# EAGLE design sd-logger (EAGLE 9.6.2)
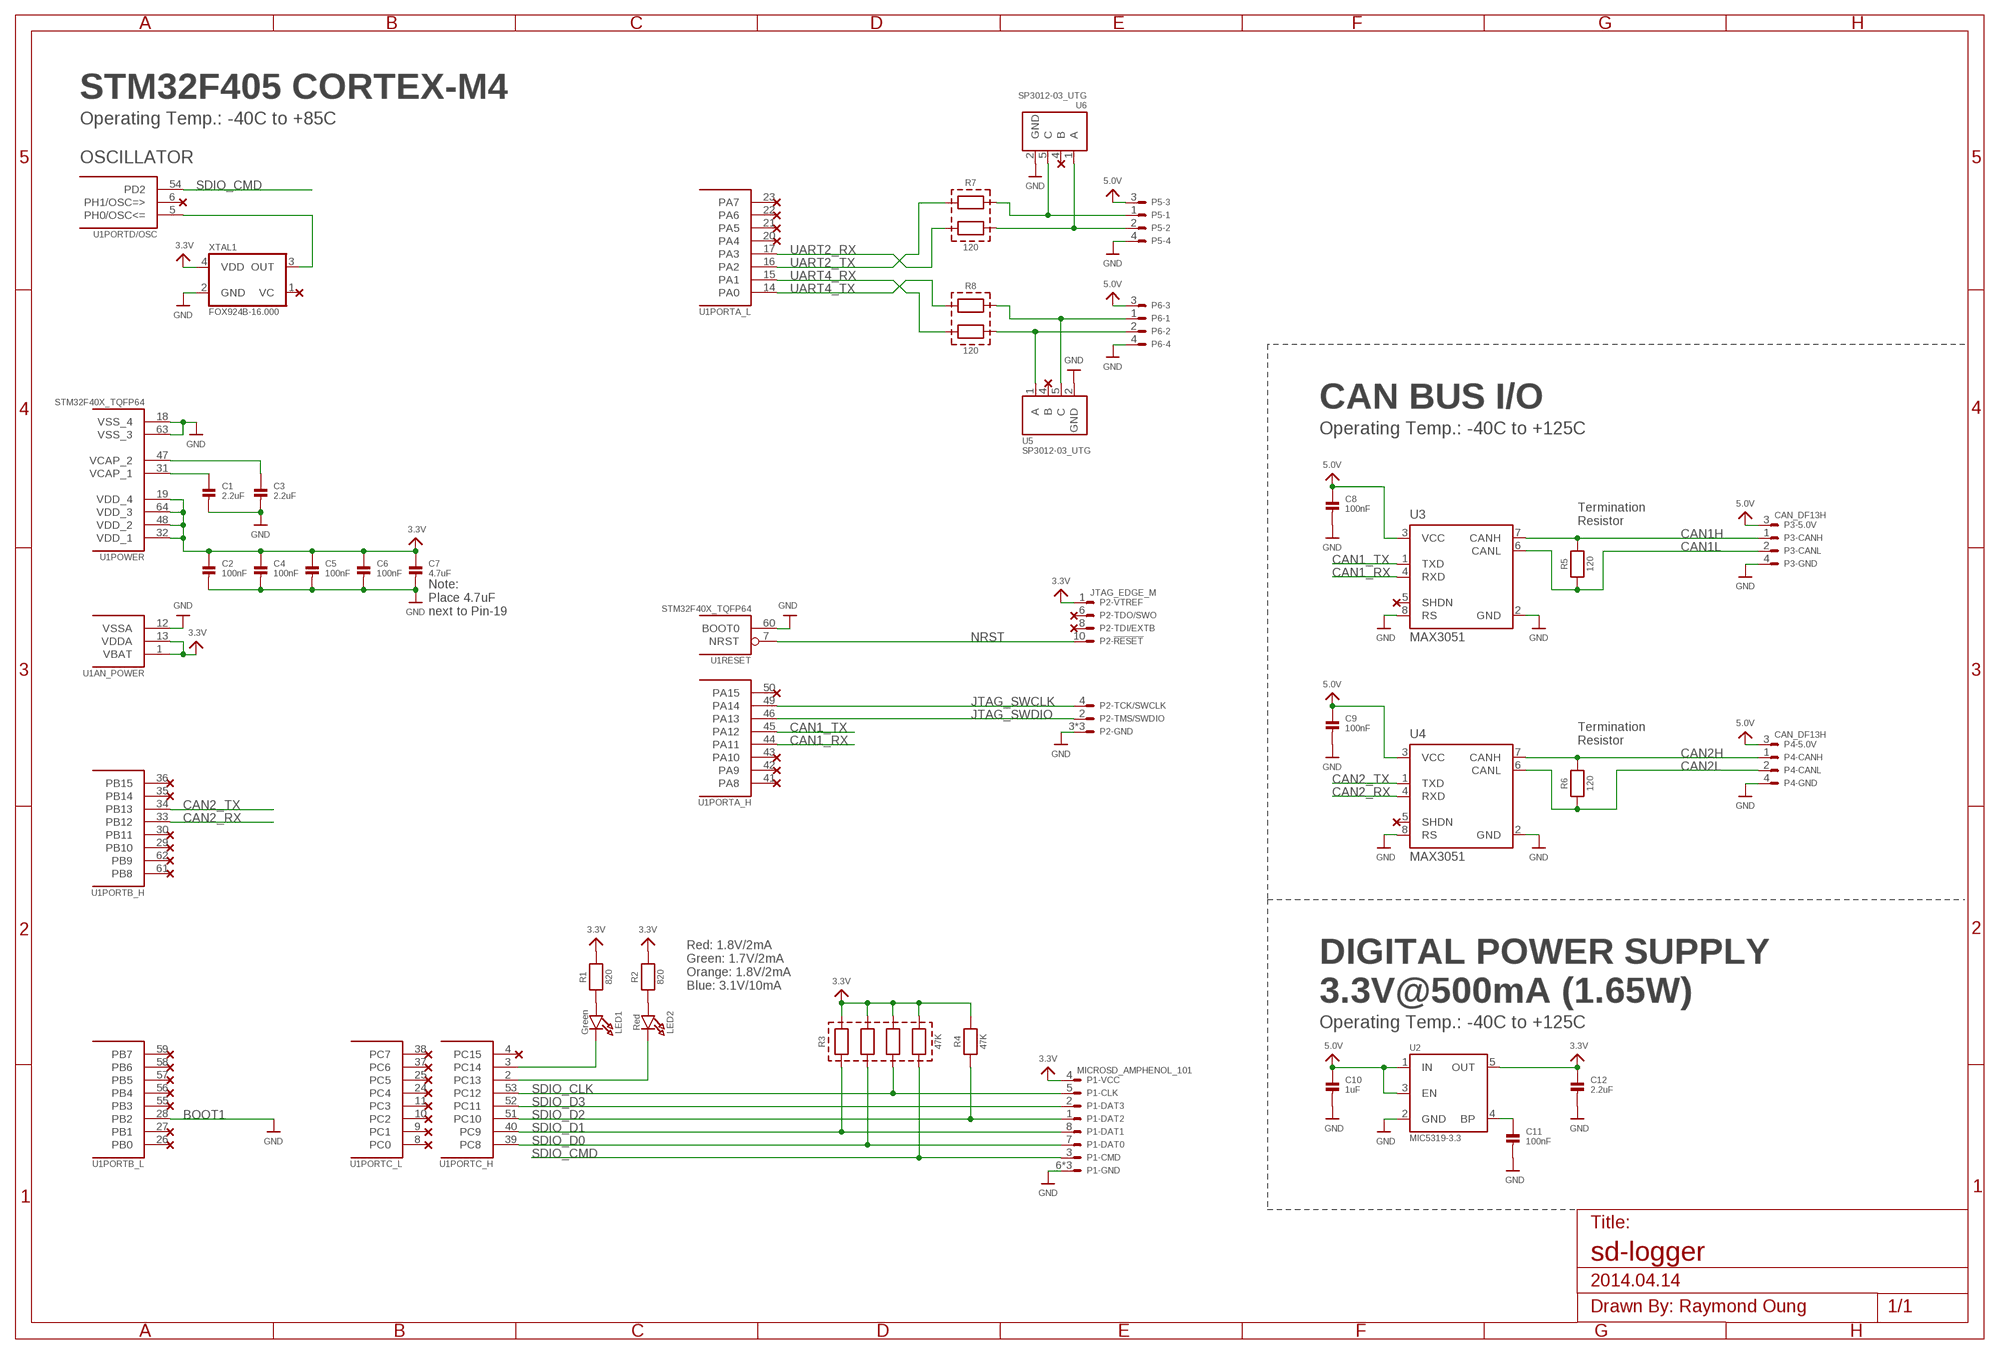
[diagram p0: schematic, sheet 1]

## Parts
C1  2.2uF  CAP_CERAMIC0402  [0402]
C2  100nF  CAP_CERAMIC0402  [0402]
C3  2.2uF  CAP_CERAMIC0402  [0402]
C4  100nF  CAP_CERAMIC0402  [0402]
C5  100nF  CAP_CERAMIC0402  [0402]
C6  100nF  CAP_CERAMIC0402  [0402]
C7  4.7uF  CAP_CERAMIC0402  [0402]
C8  100nF  CAP_CERAMIC0402  [0402]
C9  100nF  CAP_CERAMIC0402  [0402]
C10  1uF  CAP_CERAMIC0402  [0402]
C11  100nF  CAP_CERAMIC0402  [0402]
C12  2.2uF  CAP_CERAMIC0402  [0402]
LED1  Green  LED_0603  [CHIPLED_0603]
LED2  Red  LED_0603  [CHIPLED_0603]
P1  MICROSD_AMPHENOL_101  [AMPHENOL_101-00660-68]
P2  JTAG_EDGE_M  [FTSH-105-01-XXX-DV-EDGE]
P3  CAN_DF13H  [DF13A-4P-1.25H]
P4  CAN_DF13H  [DF13A-4P-1.25H]
P5  M04_DF13H  [DF13A-4P-1.25H]
P6  M04_DF13H  [DF13A-4P-1.25H]
R1  820  RESISTOR0402  [0402]
R2  820  RESISTOR0402  [0402]
R3  47K  RESISTOR4_0603X4  [EXBV8V]
R4  47K  RESISTOR0402  [0402]
R5  120  RESISTOR0603  [0603]
R6  120  RESISTOR0603  [0603]
R7  120  RESISTOR2_0603X2  [EXBV4V]
R8  120  RESISTOR2_0603X2  [EXBV4V]
U1  STM32F40X_TQFP64  [TQFP64]
U2  MIC5319-3.3  [SOT23-5]
U3  MAX3051  [SOT23-8]
U4  MAX3051  [SOT23-8]
U5  SP3012-03_UTG  [UDFN06]
U6  SP3012-03_UTG  [UDFN06]
XTAL1  FOX924B-16.000  TCXO_5.0X3.2  [OSCILLATOR-5.0X3.2]

## Nets
3.3V: C2.1 C4.1 C5.1 C6.1 C7.1 C12.1 P1.4 P2.1 R1.2 R2.2 R3.5 R3.6 R3.7 R3.8 R4.2 U1.1(AN_POWER:VBAT) U1.13(AN_POWER:VDDA) U1.19(POWER:VDD_4) U1.32(POWER:VDD_1) U1.48(POWER:VDD_2) U1.64(POWER:VDD_3) U2.5(OUT) XTAL1.4(VDD)
5.0V [PWR]: C8.1 C9.1 C10.1 P3.3 P4.3 P5.3 P6.3 U2.1(IN) U2.3(EN) U3.3(VCC) U4.3(VCC)
CAN1_RX: U1.44(PORTA_H:PA11) U3.4(RXD)
CAN1_TX: U1.45(PORTA_H:PA12) U3.1(TXD)
CAN1H: P3.1 R5.2 U3.7(CANH)
CAN1L: P3.2 R5.1 U3.6(CANL)
CAN2_RX: U1.33(PORTB_H:PB12) U4.4(RXD)
CAN2_TX: U1.34(PORTB_H:PB13) U4.1(TXD)
CAN2H: P4.1 R6.2 U4.7(CANH)
CAN2L: P4.2 R6.1 U4.6(CANL)
GND: C1.2 C2.2 C3.2 C4.2 C5.2 C6.2 C7.2 C8.2 C9.2 C10.2 C11.2 C12.2 P1.6 P1.GND1 P1.GND3 P2.3 P2.5 P2.9 P3.4 P4.4 P5.4 P6.4 U1.12(AN_POWER:VSSA) U1.18(POWER:VSS_4) U1.28(PORTB_L:PB2) U1.60(RESET:BOOT0) U1.63(POWER:VSS_3) U2.2(GND) U3.2(GND) U3.8(RS) U4.2(GND) U4.8(RS) U5.2(GND) U6.2(GND) XTAL1.2(GND)
JTAG_SWCLK: P2.4 U1.49(PORTA_H:PA14)
JTAG_SWDIO: P2.2 U1.46(PORTA_H:PA13)
N$1: P5.2 R7.3 U6.1(A)
N$2: LED1.C U1.3(PORTC_H:PC14)
N$3: U1.5(PORTD/OSC:PH0/OSC<=) XTAL1.3(OUT)
N$4: C11.1 U2.4(BP)
N$5: P5.1 R7.4 U6.5(C)
N$6: P6.2 R8.3 U5.1(A)
N$7: P6.1 R8.4 U5.5(C)
N$16: LED2.C U1.2(PORTC_H:PC13)
N$18: LED2.A R2.1
N$20: LED1.A R1.1
NRST: P2.10 U1.7(RESET:NRST)
SDIO_CLK: P1.5 R3.3 U1.53(PORTC_H:PC12)
SDIO_CMD: P1.3 R3.4 U1.54(PORTD/OSC:PD2)
SDIO_D0: P1.7 R3.2 U1.39(PORTC_H:PC8)
SDIO_D1: P1.8 R3.1 U1.40(PORTC_H:PC9)
SDIO_D2: P1.1 R4.1 U1.51(PORTC_H:PC10)
SDIO_D3: P1.2 U1.52(PORTC_H:PC11)
UART2_RX: R7.2 U1.17(PORTA_L:PA3)
UART2_TX: R7.1 U1.16(PORTA_L:PA2)
UART4_RX: R8.2 U1.15(PORTA_L:PA1)
UART4_TX: R8.1 U1.14(PORTA_L:PA0)
VCAP_3 [PWR]: C3.1 U1.47(POWER:VCAP_2)
VCAP_4 [PWR]: C1.1 U1.31(POWER:VCAP_1)
Unconnected: P2.6 P2.8 U1.4(PORTC_H:PC15) U1.6(PORTD/OSC:PH1/OSC=>) U1.8(PORTC_L:PC0) U1.9(PORTC_L:PC1) U1.10(PORTC_L:PC2) U1.11(PORTC_L:PC3) U1.20(PORTA_L:PA4) U1.21(PORTA_L:PA5) U1.22(PORTA_L:PA6) U1.23(PORTA_L:PA7) U1.24(PORTC_L:PC4) U1.25(PORTC_L:PC5) U1.26(PORTB_L:PB0) U1.27(PORTB_L:PB1) U1.29(PORTB_H:PB10) U1.30(PORTB_H:PB11) U1.35(PORTB_H:PB14) U1.36(PORTB_H:PB15) U1.37(PORTC_L:PC6) U1.38(PORTC_L:PC7) U1.41(PORTA_H:PA8) U1.42(PORTA_H:PA9) U1.43(PORTA_H:PA10) U1.50(PORTA_H:PA15) U1.55(PORTB_L:PB3) U1.56(PORTB_L:PB4) U1.57(PORTB_L:PB5) U1.58(PORTB_L:PB6) U1.59(PORTB_L:PB7) U1.61(PORTB_H:PB8) U1.62(PORTB_H:PB9) U3.5(SHDN) U4.5(SHDN) U5.4(B) U6.4(B) XTAL1.1(VC)

## Notes on the sheet
- STM32F405 CORTEX-M4
- Operating Temp.: -40C to +85C
- OSCILLATOR
- CAN BUS I/O
- Operating Temp.: -40C to +125C
- Termination
  Resistor
- Note: 
  Place 4.7uF 
  next to Pin-19
- Termination
  Resistor
- Red: 1.8V/2mA
  Green: 1.7V/2mA
  Orange: 1.8V/2mA
  Blue: 3.1V/10mA
- DIGITAL POWER SUPPLY
  3.3V@500mA (1.65W)
- Operating Temp.: -40C to +125C
- BOOT1
- 2014.04.14

## Library data of the parts
C1-C12 = custom-generic:CAP_CERAMIC: Ceramic Capacitor 0402 - 0402 Surface Mount Capacitors 16pF 50V 5% [Digikey: 445-4899-2-ND] 18pF 50V 5% [Digikey: 490-1281-2-ND] 22pF 50V 5% [Digikey: 490-1283-2-ND] 68pF 50V 5% [Digikey: 490-1289-2-ND] 0.1uF 10V 10% [Digikey: 490-1318-2-ND] 1.0uF 6.3V 10% [Digikey: 490-1320-2-ND] 0603 - 0603 Surface Mount Capacitors 16 pF 50V 5% [Digikey: 445-5051-2-ND] 22 pF 50V [Digikey: PCC220ACVTR-ND] 33 pF 50V 5% [Digikey: 490-1415-1-ND] 56pF 50V 5% [Digikey: 490-1421-1-ND] 220pF 50V 5% [Digikey: 445-1285-1-ND] 680 pF 50V 2200 pF 50V 5% C0G [Digikey: 445-1297-1-ND] 5600 pF 100V 5% X7R [Digikey: 478-3711-1-ND] 0.1 µF 25V 10% [Digikey: PCC2277TR-ND] 0.22 µF 16V 10% X7R [Digikey: 445-1318-1-ND] 1.0 µF 25V 10% [Digikey: 445-5146-2-ND] 0603 - RF Specific 3pF 250V +/-0.1pF RF [Digikey: 712-1347-1-ND] 18 pF 250V 5% [Digikey: 478-3505-1-ND or 712-1322-1-ND] 56 pF 250V 5% C0G RF [Digikey: 490-4867-1-ND] 68 pF 250V RF [Digikey: 490-4868-1-ND] 0805 - 0805 Surface Mount Capacitors 220 pF 250V 2% RF Ceramic Capacitor [Digikey: 712-1398-1-ND] 1000 pF 50V 2% NP0 Ceramic Capacitor [Digikey: 478-3760-1-ND] 0.1 µF 25V 10% Ceramic Capacitor [Digikey: PCC1828TR-ND] 1.0 µF 16V 10% Ceramic Capacitor[Digikey: 490-1691-2-ND] 10.0 µF 10V 10% Ceramic Capacitor[Digikey: 709-1228-1-ND] 10.0 uF 16V 10% Ceramic Capacitor [Digikey: 478-5165-2-ND] 47 uF 6.3V 20% Ceramic Capacitor [Digikey: 587-1779-1-ND or 399-5506-1-ND] 1206 - 1206 Surface Mount Capacitors 47uF 10V 20% Ceramic Capacitor [Digikey: 490-5528-1-ND or 399-5508-1-ND or 445-6010-1-ND]
LED1 LED2 = custom-generic:LED: LED 0603 - 0603 Surface Mount Package 2mA: Blue LED - Low Power (39.2mcd, 10 mA, 3.1Vf) - DigiKey: 475-1383-1-ND Green LED - Low Power (3.9mcd, 2mA, 1.7Vf) - Digikey: 475-2709-1-ND Orange LED - Low Power (9.8mcd, 2mA, 1.8Vf) - Digikey: 475-1194-2-ND Red LED - Low Power (5mcd, 2mA, 1.8Vf) - Digikey: 475-2506-1-ND Yellow LED - Low Power (7mcd, 2mA, 1.8Vf) - Digikey: 475-1196-1-ND 5mA: Blue LED - Low Power (17mcd, 5ma, 2.9Vf) - Digikey: LNJ937W8CRACT-ND 0805 - 0805 Surface Mount Package 2mA: Red LED (8.8mcd, 2mA, 1.8Vf, Clear) - Low Power [Digikey: 475-2510-1-ND] Green LED (5mcd, 2mA, 1.8Vf, Clear) - Low Power [Digikey: 475-2730-1-ND] Yellow LED (11.3mcd, 2mA, 1.8Vf, Clear) - Low Power [Digikey: 475-2555-1-ND] 20mA: Red LED (104mcd, 20mA, Diffused) - LS R976 [Digikey: 475-1278-6-ND] Red LED (12mcd, 20mA, 2.0Vf, Clear) - APT2012EC [Digikey: 754-1128-1-ND] Green LED (15mcd, 20mA, 2.2Vf, Clear) - APT2012GC [Digikey: 754-1131-1-ND] Orange LED (160mcd, 20mA, 2.1Vf, Clear) - APT2012SECK [Digikey: 754-1130-1-ND] 1206 - 1206 Surface Mount Package Green LED (26mcd, 20mA, Diffused) - LG N971 [Digikey: 475-1407-6-ND] Red LED (15mcd, 20mA, Diffused) - LH N974 [Digikey: 475-1416-6-ND]
P1 = custom-connectors:MICROSD: SD Card; DIGI-KEY: 101-00660-68-6-1-ND; MOUSER: 523-101-00660-68-6
P2 = custom-connectors:JTAG: JTAG Connector; DIGI-KEY: 952-1383-ND; MOUSER: 855-M50-3500542; TEMPERATURE: -40°C to 105°C
P3 P4 = custom-connectors:CAN: CAN Bus Connector; DIGI-KEY: H3369-ND; MOUSER: 798-DF13A4P125H20
P5 P6 = custom-connectors:M04: 4-Way Connector; DIGI-KEY: H3369-ND; MOUSER: 798-DF13A4P125H20; TEMPERATURE: -35°C to +85°C
R1 R2 R4-R6 = custom-generic:RESISTOR: Resistors 0402 - 0402 Surface Mount Package 22 Ohm 1% 1/16W [Digikey: 311-22.0LRTR-ND] 33 Ohm 5% 1/16W 1.0K 5% 1/16W 1.5K 5% 1/16W 2.0K 1% 1/16W 10.0K 1% 1/16W [Digikey: 311-10.0KLRTR-ND] 10.0K 5% 1/16W [Digikey: RMCF0402JT10K0TR-ND] 12.1K 1% 1/16W [Digikey: 311-22.0LRTR-ND] 100.0K 5% 1/16W 0603 - 0603 Surface Mount Package 0 Ohm 1/10 Watt 1% Resistor 15 Ohm 1/10 Watt 1% Resistor 33 Ohm 1/10 Watt 1% Resistor 49.9 Ohm 1/10 Watt 1% Resistor 100 Ohm 1/10 Watt 1% Resistor 150 Ohm 1/10 Watt 1% Resistor 240 Ohm 1/10 Watt 1% Resistor 390 Ohm 1/10 Watt 1% Resistor 560 Ohm 1/10 Watt 1% Resistor 680 Ohm 1/10 Watt 1% Resistor 750 Ohm 1/10 Watt 1% Resistor 1.0K Ohm 1/10 Watt 1% Resistor 1.5K Ohm 1/10 Watt 1% Resistor 2.0K Ohm 1/10 Watt 1% Resistor 2.2K Ohm 1/10 Watt 1% Resistor 3.3K Ohm 1/10 Watt 1% Resistor 4.7K Ohm 1/10 Watt 1% Resistor 10.0K Ohm 1/10 Watt 1% Resistor 12.0K Ohm 1/10 Watt 1% Resistor 12.1K Ohm 1/10 Watt 1% Resistor 20.0K Ohm 1/10 Watt 1% Resistor 33.0K Ohm 1/10 Watt 1% Resistor 100.0K Ohm 1/10 Watt 1% Resistor 0805 - 0805 Surface Mount Package 0 Ohm 1/8 Watt 1% Resistor 33 Ohm 1/8 Watt 1% Resistor 100 Ohm 1/8 Watt 1% Resistor 150 Ohm 1/8 Watt 1% Resistor 200 Ohm 1/8 Watt 1% Resistor 240 Ohm 1/8 Watt 1% Resistor 330 Ohm 1/8 Watt 1% Resistor 390 Ohm 1/8 Watt 1% Resistor 470 Ohm 1/8 Watt 1% Resistor 1.0K Ohm 1/8 Watt 1% Resistor 1.5K Ohm 1/8 Watt 1% Resistor 2.0K Ohm 1/8 Watt 1% Resistor 4.7K Ohm 1/8 Watt 1% Resistor 5.1K Ohm 1/8 Watt 1% Resistor 5.6K Ohm 1/8 Watt 1% Resistor 10.0K Ohm 1/8 Watt 1% Resistor 22.0K Ohm 1/8 Watt 1% Resistor 33.0K Ohm 1/8 Watt 1% Resistor 100K Ohm 1/8 Watt 1% Resistor 1206 - 1206 Surface Mount Package 2012 - 2010 Surface Mount Package 0.11 Ohm 1/2 Watt 1% Resistor - Digikey: RHM.11UCT-ND
R3 = custom-generic:RESISTOR4: 4x Isolated Resistor Network
R7 R8 = custom-generic:RESISTOR2: 2x Isolated Resistor Network
U1 = custom-devices:STM32F40X_TQFP64: STM32F40x 64-pin LQFP; DIGI-KEY: 497-11767-ND; MOUSER: 511-STM32F405RGT6
U2 = custom-devices:MIC5319-3.3: 3.3V Linear Voltage Regulator; DIGI-KEY: 576-1910-1-ND; MOUSER: 998-MIC5319-3.3YD5TR
U3 U4 = custom-devices:MAX3051: CAN Transceiver; DIGI-KEY: MAX3051EKA+TCT-ND; MOUSER: 700-MAX3051EKAT
U5 U6 = custom-devices:SP3012-03: TVS Diode Arrays 3-Ch 12KV 0.5pF; DIGI-KEY: F6292CT-ND; MOUSER: 576-SP3012-03UTG; TEMPERATURE: -40°C to +125°C
XTAL1 = custom-generic:TCXO: Temperature Compensated Crystal Oscillator

## Net classes
0 default: width 0.203 mm, drill 0.305 mm, clearance 0.203 mm
1 PWR: width 0.203 mm, drill 0.305 mm, clearance 0.203 mm

## Board
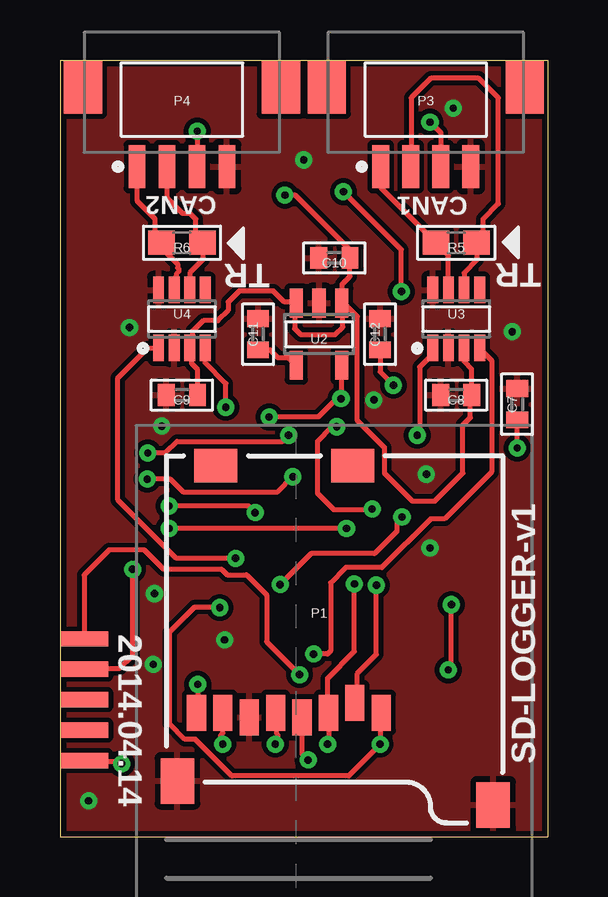
[diagram p1: board, top side]
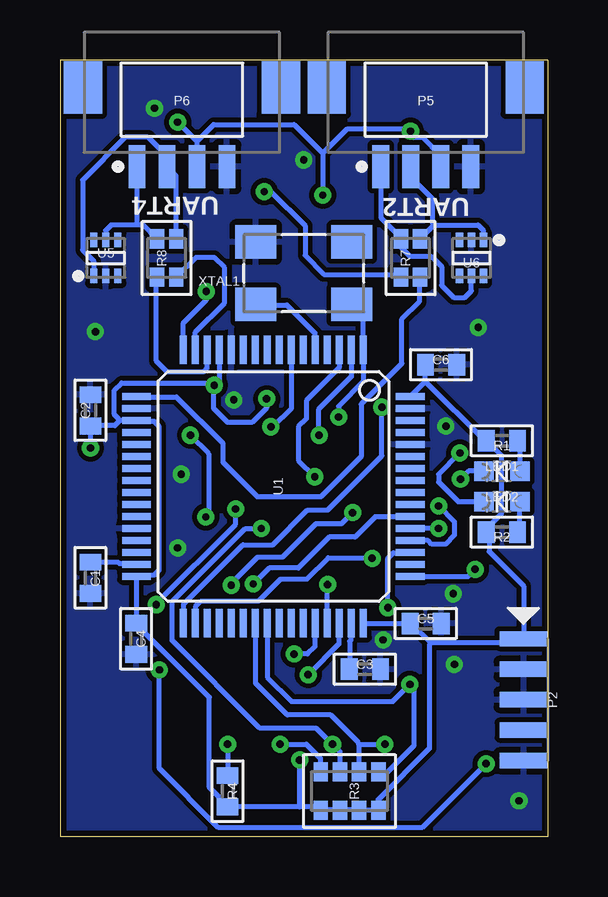
[diagram p2: board, bottom side, seen from below]

Size 20.32 x 32.38 mm. Coordinates in mm from the lower left corner, seen from the top.
Outline: 0,0 20.32,0 20.32,32.38 0,32.38 0,0
Copper layers (1*16): Top 0.035mm / dielectric 1.5mm / Bottom 0.035mm
Design rules "BetaLayout-2layer": minimum track width 6mil, minimum drill 8mil, track to track 6mil, track to pad 6mil, pad to pad 6mil, via to via 6mil, smd to smd 0mil, copper to edge 10mil, drill to drill 10mil, minimum pad ring 10mil, minimum via ring 8mil, stop-mask expansion 2mil, vias tented up to drill 100mil, thermal gap 10mil

### Footprints (pad centres in the part's own frame; a part is rotated, then mirrored left to right if it is on the bottom)
0402 = smd 0.7 x 0.9: 1 -0.65,0; 2 0.65,0
CHIPLED_0603 = smd 0.8 x 0.8: A 0,-0.75; C 0,0.75
AMPHENOL_101-00660-68 = smd 0.8 x 1.5: 1 -8.94,10.7; 2 -7.84,10.3; 3 -6.74,10.7; 4 -5.64,10.9; 5 -4.54,10.7; 6 -3.44,10.9; 7 -2.34,10.7; 8 -1.24,10.7 | smd 1.8 x 1.4: CD1 -2.05,0.4; CD2 -7.75,0.4 | smd 1.4 x 1.9: GND1 -13.6,14.55; GND3 -0.45,13.55
FTSH-105-01-XXX-DV-EDGE = smd 0.635 x 2: 1 -2.54,-1; 3 -1.27,-1; 5 0,-1; 7 1.27,-1; 9 2.54,-1 | smd 0.635 x 2 bottom: 2 -2.54,-1; 4 -1.27,-1; 6 0,-1; 8 1.27,-1; 10 2.54,-1
DF13A-4P-1.25H = smd 0.7 x 1.8: 1 -1.875,0; 2 -0.625,0; 3 0.625,0; 4 1.875,0 | smd 1.6 x 2.2: NC1 -4.125,3.3; NC2 4.125,3.3
EXBV8V = smd 0.8 x 0.6: 1 -0.8,1.2; 2 -0.8,0.4; 3 -0.8,-0.4; 4 -0.8,-1.2; 5 0.8,-1.2; 6 0.8,-0.4; 7 0.8,0.4; 8 0.8,1.2
0603 = smd 1.1 x 1: 1 -0.85,0; 2 0.85,0
EXBV4V = smd 0.8 x 0.6: 1 -0.8,0.4; 2 -0.8,-0.4; 3 0.8,-0.4; 4 0.8,0.4
TQFP64 = smd 1.2 x 0.29: 1 -5.7,3.75; 2 -5.7,3.25; 3 -5.7,2.75; 4 -5.7,2.25; 5 -5.7,1.75; 6 -5.7,1.25; 7 -5.7,0.75; 8 -5.7,0.25; 9 -5.7,-0.25; 10 -5.7,-0.75; 11 -5.7,-1.25; 12 -5.7,-1.75; 13 -5.7,-2.25; 14 -5.7,-2.75; 15 -5.7,-3.25; 16 -5.7,-3.75; 33 5.7,-3.75; 34 5.7,-3.25; 35 5.7,-2.75; 36 5.7,-2.25; 37 5.7,-1.75; 38 5.7,-1.25; 39 5.7,-0.75; 40 5.7,-0.25; 41 5.7,0.25; 42 5.7,0.75; 43 5.7,1.25; 44 5.7,1.75; 45 5.7,2.25; 46 5.7,2.75; 47 5.7,3.25; 48 5.7,3.75 | smd 0.29 x 1.2: 17 -3.75,-5.7; 18 -3.25,-5.7; 19 -2.75,-5.7; 20 -2.25,-5.7; 21 -1.75,-5.7; 22 -1.25,-5.7; 23 -0.75,-5.7; 24 -0.25,-5.7; 25 0.25,-5.7; 26 0.75,-5.7; 27 1.25,-5.7; 28 1.75,-5.7; 29 2.25,-5.7; 30 2.75,-5.7; 31 3.25,-5.7; 32 3.75,-5.7; 49 3.75,5.7; 50 3.25,5.7; 51 2.75,5.7; 52 2.25,5.7; 53 1.75,5.7; 54 1.25,5.7; 55 0.75,5.7; 56 0.25,5.7; 57 -0.25,5.7; 58 -0.75,5.7; 59 -1.25,5.7; 60 -1.75,5.7; 61 -2.25,5.7; 62 -2.75,5.7; 63 -3.25,5.7; 64 -3.75,5.7
SOT23-5 = smd 0.55 x 1.2: 1 -0.95,-1.3; 2 0,-1.3; 3 0.95,-1.3; 4 0.95,1.3; 5 -0.95,1.3
SOT23-8 = smd 0.45 x 1.1: 1 -0.975,-1.204; 2 -0.325,-1.204; 3 0.325,-1.204; 4 0.975,-1.204; 5 0.975,1.204; 6 0.325,1.204; 7 -0.325,1.204; 8 -0.975,1.204
UDFN06 = smd 0.3 x 0.6: 1 -0.5,-0.75; 2 0,-0.75; 3 0.5,-0.75; 4 0.5,0.75; 5 0,0.75; 6 -0.5,0.75
OSCILLATOR-5.0X3.2 = smd 1.7 x 1.4: 1 -2,-1.3; 2 2,-1.3; 3 2,1.3; 4 -2,1.3

### Placement (x,y rotation side)
C1  19.05,10.79 270 bottom
C2  19.05,17.78 90 bottom
C3  7.62,6.99 0 bottom
C4  17.14,8.26 270 bottom
C5  5.08,8.89 0 bottom
C6  4.45,19.68 0 bottom
C7  19.05,18.03 90 top
C8  16.51,18.41 180 top
C9  5.08,18.41 180 top
C10  11.43,24.13 180 top
C11  8.26,20.95 90 top
C12  13.34,20.95 90 top
LED1  1.91,15.24 90 bottom
LED2  1.91,13.97 90 bottom
P1  4.45,15.88 180 top
P2  0,5.71 270 bottom
P3  15.24,27.94 0 top
P4  5.08,27.94 0 top
P5  5.08,27.94 0 bottom
P6  15.24,27.94 0 bottom
R1  1.91,16.51 180 bottom
R2  1.91,12.7 180 bottom
R3  8.26,1.91 270 bottom
R4  13.34,1.91 270 bottom
R5  16.51,24.77 180 top
R6  5.08,24.77 180 top
R7  5.71,24.13 90 bottom
R8  15.88,24.13 90 bottom
U1  11.43,14.61 270 bottom
U2  10.79,20.95 180 top
U3  16.51,21.59 0 top
U4  5.08,21.59 0 top
U5  18.41,24.13 0 bottom
U6  3.17,24.13 180 bottom
XTAL1  10.16,23.5 180 bottom

### Tracks (layer width: path | path; a pad name or v marks a point on that pad's centre or on a via)
3.3V  (via drill 0.3)
  Top 0.203: v19.05,16.2 C7.1 | 11.66,19.66 U2.5 11.76,19.63 11.86,19.63 11.71,19.48 11.73,19.46 11.71,19.43 v11.71,18.26 11.53,18.26 10.77,17.5 v8.71,17.5 | v10.34,3.2 10.08,3.45 10.08,4.95 P1.4 | C12.1 13.34,19.38 v13.89,18.82
  Bottom 0.203: XTAL1.4 8.15,22.17 7.7,21.72 7.7,20.32 U1.1 7.68,18.99 8.71,17.96 v8.71,17.5 | U1.13 13.69,20.3 13.69,19.02 v13.89,18.82 | 17.83,17.35 18.03,17.14 19.05,17.14 C2.1 v19.05,16.2 | 17.83,17.35 17.14,17.35 U1.19 17.04,17.32 16.41,17.32 16.2,17.12 16.2,11.1 16.41,10.9 17.04,10.9 U1.32 17.14,10.85 C4.1 17.09,8.81 14.1,5.82 14.1,2.06 13.39,1.35 R4.2 10.34,1.25 | 17.83,17.35 17.88,17.42 18.06,17.6 18.06,18.62 17.75,18.92 13.99,18.92 v13.89,18.82 | 10.34,1.25 9.6,1.25 9.53,1.17 R3.5 9.45,1.12 8.74,1.12 R3.6 8.64,1.12 7.95,1.12 R3.7 7.85,1.12 7.06,1.12 R3.8 7.06,1.22 7.06,1.55 4.93,3.68 4.93,8 4.88,8.08 | 10.34,1.25 v10.34,3.2 | U1.48 7.67,8.89 C5.1 5.64,8.84 4.88,8.08 | 4.88,8.08 1.19,8.08 1.02,8.26 P2.1 1,10.45 2.44,11.89 2.44,12.42 2.36,12.5 2.49,12.62 R2.2 2.54,12.7 2.54,12.85 1.93,13.46 1.93,15.9 2.54,16.51 R1.2 2.64,16.54 5.03,18.92 5.11,18.97 | 5.11,18.97 C6.1 | 5.11,18.97 5.71,18.36 U1.64 | v11.71,18.26 11.71,17.88 12.32,17.27 13.34,17.27 13.92,17.86 13.92,18.8 v13.89,18.82
5.0V  (via drill 0.3, 0.3 pad 0.71)
  Top 0.203: v5.71,29.41 P4.3 | 16.94,20.27 16.84,20.37 U3.3 16.84,19.82 17.14,19.51 17.14,18.41 C8.1 17.09,18.34 17.09,17.48 16.79,17.17 16.79,15.16 15.62,13.99 14.68,13.99 13.51,15.16 13.51,16.23 12.39,17.35 12.39,21.69 11.83,22.25 U2.1 | 5.51,20.27 5.41,20.37 U4.3 | C9.1 5.71,18.41 5.71,19.51 5.49,19.74 5.49,20.3 U4.3 | 12.06,24.13 C10.1 | U2.1 11.76,22.28 11.79,22.3 11.76,22.3 11.76,23.04 12.08,23.36 C10.1 | U2.3 9.78,22.3 | 11.73,22.17 U2.1 | 5.44,20.47 U4.3 | 15.85,27.94 P3.3 15.87,29.35 v15.42,29.79 | C10.1 12.17,24.18 12.27,24.28 9.8,26.75 v9.37,26.75 | C10.1 | 9.78,22.3 9.35,22.3 8.89,22.76 7.47,22.76 7.01,22.3 7.01,21.95 6.58,21.51 5.97,21.51 5.51,21.06 5.51,20.49 U4.3 | 9.78,22.3 9.78,21.18 10.03,20.93 11.46,20.93 11.79,21.26 11.79,22.21 U2.1
  Bottom 0.203: 5.71,29.16 5.23,29.16 4.47,28.4 P5.3 | P6.3 14.61,27.94 14.61,28.98 | 5.71,29.16 v5.71,29.41 | 14.61,28.98 v15.42,29.79 | 5.71,29.16 6.04,29.49 8.38,29.49 9.37,28.5 | 9.35,26.77 v9.37,26.75 9.37,28.5 | 14.61,28.98 14.61,29.01 13.92,29.69 10.57,29.69 9.37,28.5
CAN1_RX  (via drill 0.3)
  Top 0.203: U3.4 17.48,20.37 17.98,19.86 17.98,15.21 16.03,13.26 15.44,13.26 13.41,11.23 11.89,11.23 11.89,11.2 11.28,10.59 11.28,7.75 11.15,7.62 v10.57,7.62
  Bottom 0.203: U1.44 9.7,8.89 9.7,7.92 10.01,7.62 v10.57,7.62
CAN1_TX  (via drill 0.3 pad 0.71)
  Top 0.203: v9.17,10.52 10.46,11.81 13.11,11.81 14.05,12.75 14.05,13.13 v14.25,13.34 | U3.1 15.54,20.13 14.99,19.58 14.99,16.84 v14.88,16.74
  Bottom 0.203: U1.45 9.18,10.51 v9.17,10.52 | v14.25,13.34 14.12,13.46 14.12,15.98 v14.88,16.74
CAN1H
  Top 0.203: 15.42,24.97 15.57,24.82 R5.2 | 15.28,24.38 R5.2 | P3.1 13.37,27.06 R5.2 | U3.7 16.18,24.24 R5.2
CAN1L
  Top 0.203: U3.6 16.84,22.81 16.84,23.52 17.37,24.05 17.37,24.77 R5.1 17.42,24.84 17.63,25.04 17.63,25.76 18.26,26.39 18.26,30.81 17.45,31.62 15.44,31.62 14.63,30.81 P3.2
CAN2_RX  (via drill 0.3)
  Top 0.203: v6.91,17.91 6.91,18.9 6.04,19.76 6.04,20.37 U4.4
  Bottom 0.203: U1.33 15.16,8.91 15.16,9.7 12.7,12.17 11.46,12.17 10.01,13.61 9.17,13.61 6.91,15.88 v6.91,17.91
CAN2_TX  (via drill 0.3)
  Top 0.203: v7.32,11.61 4.85,11.61 2.41,14.05 2.41,19.13 3.66,20.37 4.09,20.37 U4.1
  Bottom 0.203: U1.34 14.66,8.91 14.66,9.63 14.45,9.83 12.04,9.83 11.12,10.74 10.03,10.74 9.14,11.63 7.34,11.63 v7.32,11.61
CAN2H
  Top 0.203: U4.7 4.78,22.81 4.78,23.29 4.85,23.37 4.85,23.47 4.95,23.57 4.95,23.67 4.9,23.72 4.9,23.88 4.24,24.54 4.24,24.77 R6.2 4.17,24.84 3.96,25.04 3.96,25.76 3.23,26.49 3.23,27.94 P4.1
CAN2L
  Top 0.203: U4.6 5.41,22.81 5.41,23.52 5.94,24.05 5.94,24.77 R6.1 5.87,24.84 5.66,25.04 5.66,25.76 5.44,25.98 5.11,25.98 4.47,26.62 P4.2
GND  (via drill 0.3 pad 0.71)
  other vias: 10.16,28.22 18.85,21.06 15.27,15.11 15.42,12.04 6.86,8.2 3.94,10.13 3.89,7.19 13.08,18.21 16.38,30.38 4.24,17.12 2.9,21.23 1.19,1.5
  pour Top: 0,0 20.32,0 20.32,32.38 0,32.38
  pour Bottom: 0,0 20.32,0 20.32,32.38 0,32.38
JTAG_SWCLK  (via drill 0.3)
  Top 0.203: P2.4 1.02,6.99 1.04,7.01 2.46,7.01 3.02,7.57 v3.02,11.15
  Bottom 0.203: U1.49 5.71,10.85 3.33,10.85 v3.02,11.15
JTAG_SWDIO  (via drill 0.3)
  Top 0.203: 1.02,8.36 1.02,8.26 P2.2 1,10.91 2.06,11.96 3.5,11.96 4.32,11.15 6.73,11.15 6.96,10.92 7.77,10.92 8.61,10.08 8.61,8.13 v9.98,6.76
  Bottom 0.203: U1.46 8.69,8.89 8.69,8.05 v9.98,6.76
N$1
  Bottom 0.203: 4.75,25.5 2.9,25.5 2.69,25.3 2.69,24.89 U6.1 | 4.75,25.5 5.31,24.94 R7.3 | 4.75,25.5 4.8,25.58 4.8,26.59 5.69,27.48 5.69,27.94 P5.2
N$2  (via drill 0.3)
  Top 0.203: v9.7,15.01 9.07,14.38 5.13,14.38 4.6,14.91 v3.63,14.91
  Bottom 0.203: U1.3 8.69,19.56 10.06,18.19 10.06,17.42 10.39,17.09 10.39,15.7 v9.7,15.01 9.75,15.06 | LED1.C 3.3,15.24 v3.63,14.91
N$3
  Bottom 0.203: U1.5 9.7,20.32 9.7,21.01 10.87,22.17 12.14,22.17 XTAL1.3
N$4
  Top 0.203: C11.1 8.76,20.3 9.09,19.96 9.53,19.96 9.83,19.66 U2.4
N$5
  Bottom 0.203: P5.1 6.93,27.94 6.93,25.78 6.17,25.02 R7.4 6.1,24.92 6.1,24.56 5.74,24.21 4.85,24.21 4.42,23.77 4.42,22.99 3.91,22.48 3.45,22.48 3.17,22.76 U6.5
N$6
  Bottom 0.203: U5.1 18.92,23.39 18.92,24 19.38,24.46 19.38,27.38 17.6,29.16 16.64,29.16 15.88,28.4 P6.2 15.8,27.86 15.49,27.56 15.49,24.94 R8.3
N$7
  Bottom 0.203: U5.5 18.41,25.27 18.19,25.5 17.12,25.5 | 17.12,25.5 16.84,25.5 16.28,24.94 R8.4 | 17.12,25.5 P6.1
N$16  (via drill 0.3)
  Top 0.203: v3.66,16 4.39,16 4.88,16.48 9.27,16.48 v9.53,16.74
  Bottom 0.203: U1.2 8.18,19.18 9.55,17.8 9.55,16.76 v9.53,16.74 | v3.66,16 4.55,15.11 4.55,14.78 3.73,13.97 LED2.C
N$18
  Bottom 0.203: LED2.A 1.17,12.78 R2.1
N$20
  Bottom 0.203: LED1.A 1.17,16.43 R1.1
NRST  (via drill 0.3)
  Top 0.203: v16.31,9.68 16.31,7.09 v16.18,6.96 | v2.56,3.05 2.46,3.15 1.04,3.15 1.02,3.17 P2.10 | v13.01,13.66 12.98,13.64 11.4,13.64 10.72,14.33 10.72,16.46 11.35,17.09 v11.53,17.09
  Bottom 0.203: v16.31,9.68 16.31,9.73 13.01,13.03 v13.01,13.66 | v16.18,6.96 16.18,2.85 13.72,0.38 5.23,0.38 v2.56,3.05 | U1.7 10.69,20.3 10.69,17.83 11.43,17.09 v11.53,17.09
SDIO_CLK  (via drill 0.3)
  Top 0.203: v8.97,3.86 8.99,3.89 8.99,3.91 9.07,3.99 9.07,4.27 9.02,4.32 9.02,5.13 8.99,5.16 P1.5 | v11.94,12.85 v4.55,12.85
  Bottom 0.203: R3.3 8.66,3.56 v8.97,3.86 9.04,3.91 9.65,4.52 11.99,4.52 15.65,8.18 15.65,9.8 12.6,12.85 v11.94,12.85 | v4.55,12.85 5.71,12.85 U1.53
SDIO_CMD  (via drill 0.3)
  Top 0.203: v11.15,3.86 11.2,3.91 11.2,5.16 P1.3 11.15,5.26 11.15,6.6 12.27,7.72 v12.27,10.54
  Bottom 0.203: v11.15,3.86 10.06,3.86 9.47,3.28 9.47,2.72 R3.4 | v12.27,10.54 11.61,11.2 10.39,11.2 9.09,12.5 8.03,12.5 7.19,13.34 5.74,13.34 U1.54
SDIO_D0  (via drill 0.3)
  Top 0.203: v6.78,3.86 6.71,3.94 6.71,4.24 6.78,4.32 6.78,5.16 P1.7
  Bottom 0.203: 7.87,3.86 7.87,3.91 9.04,5.08 10.85,5.08 12.17,6.4 12.17,8.89 U1.39 | 7.87,3.86 7.87,2.72 R3.2 | 7.87,3.86 v6.78,3.86
SDIO_D1  (via drill 0.3 pad 0.71)
  Top 0.203: v5.74,6.35 5.74,5.23 P1.8
  Bottom 0.203: U1.40 11.68,6.65 10.67,5.64 6.45,5.64 v5.74,6.35 5.56,6.17 5.56,3.81 6.67,2.71 R3.1
SDIO_D2  (via drill 0.3)
  Top 0.203: P1.1 13.36,5.16 13.34,5.13 v13.34,3.86 13.28,3.79 12.04,2.54 7.16,2.54 5.64,4.06 5.21,4.06 4.57,4.7 4.57,8.53 5.61,9.58 6.63,9.58 v6.66,9.55
  Bottom 0.203: v13.34,3.86 R4.1 | v6.66,9.55 6.66,11.61 6.43,11.84 5.74,11.84 U1.51
SDIO_D3  (via drill 0.3)
  Top 0.203: v13.18,10.49 13.18,7.59 12.39,6.81 12.39,5.69 12.29,5.59 P1.2 | v4.55,13.79 7.85,13.79 v8.13,13.51
  Bottom 0.203: v4.55,13.79 3.89,13.13 3.89,12.57 4.27,12.19 4.83,12.19 4.98,12.34 5.71,12.34 U1.52 | v13.18,10.49 13.18,10.57 12.09,11.66 11.05,11.66 9.65,13.06 8.59,13.06 v8.13,13.51
UART2_RX
  Bottom 0.203: R7.2 5.33,23.32 5.36,23.29 5.36,22.3 6.07,21.59 6.07,19.74 7.77,18.03 7.77,15.85 9.45,14.17 12.09,14.17 13.54,15.62 13.54,16.41 15.47,18.34 17.12,18.34 U1.17
UART2_TX  (via drill 0.3 pad 0.71)
  Top 0.203: v14.22,22.73 14.22,24.49 v11.81,26.9
  Bottom 0.203: U1.16 15.18,21.42 14.22,22.38 v14.22,22.73 | v11.81,26.9 11.53,26.9 10.11,25.48 10.11,24.23 9.32,23.44 6.23,23.44 R7.1
UART4_RX
  Bottom 0.203: 15.47,23.32 R8.2 | 14.68,20.32 U1.15 14.68,21.03 13.46,22.25 13.46,23.72 13.89,24.16 14.65,24.16 R8.2 | 15.39,23.37 15.41,23.39 R8.2
UART4_TX
  Bottom 0.203: U1.14 14.2,20.32 14.2,19.53 14.35,19.38 15.85,19.38 16.31,19.84 16.31,23.3 R8.1
VCAP_3
  Bottom 0.203: C3.1 8.26,6.99 8.26,8.15 8.2,8.2 8.2,8.89 U1.47
VCAP_4
  Bottom 0.203: C1.1 19.05,11.43 17.88,11.43 17.83,11.38 17.14,11.38 U1.31

### Text on the board
tPlace: CAN2 | CAN1 | TR | TR | SD-LOGGER-v1 | 2014.04.14
bPlace: UART2 | UART4